# Altium schematic sheet Sheet1.SchDoc
size 279 x 279 mm; SheetNumber: 1; SheetTotal: 1
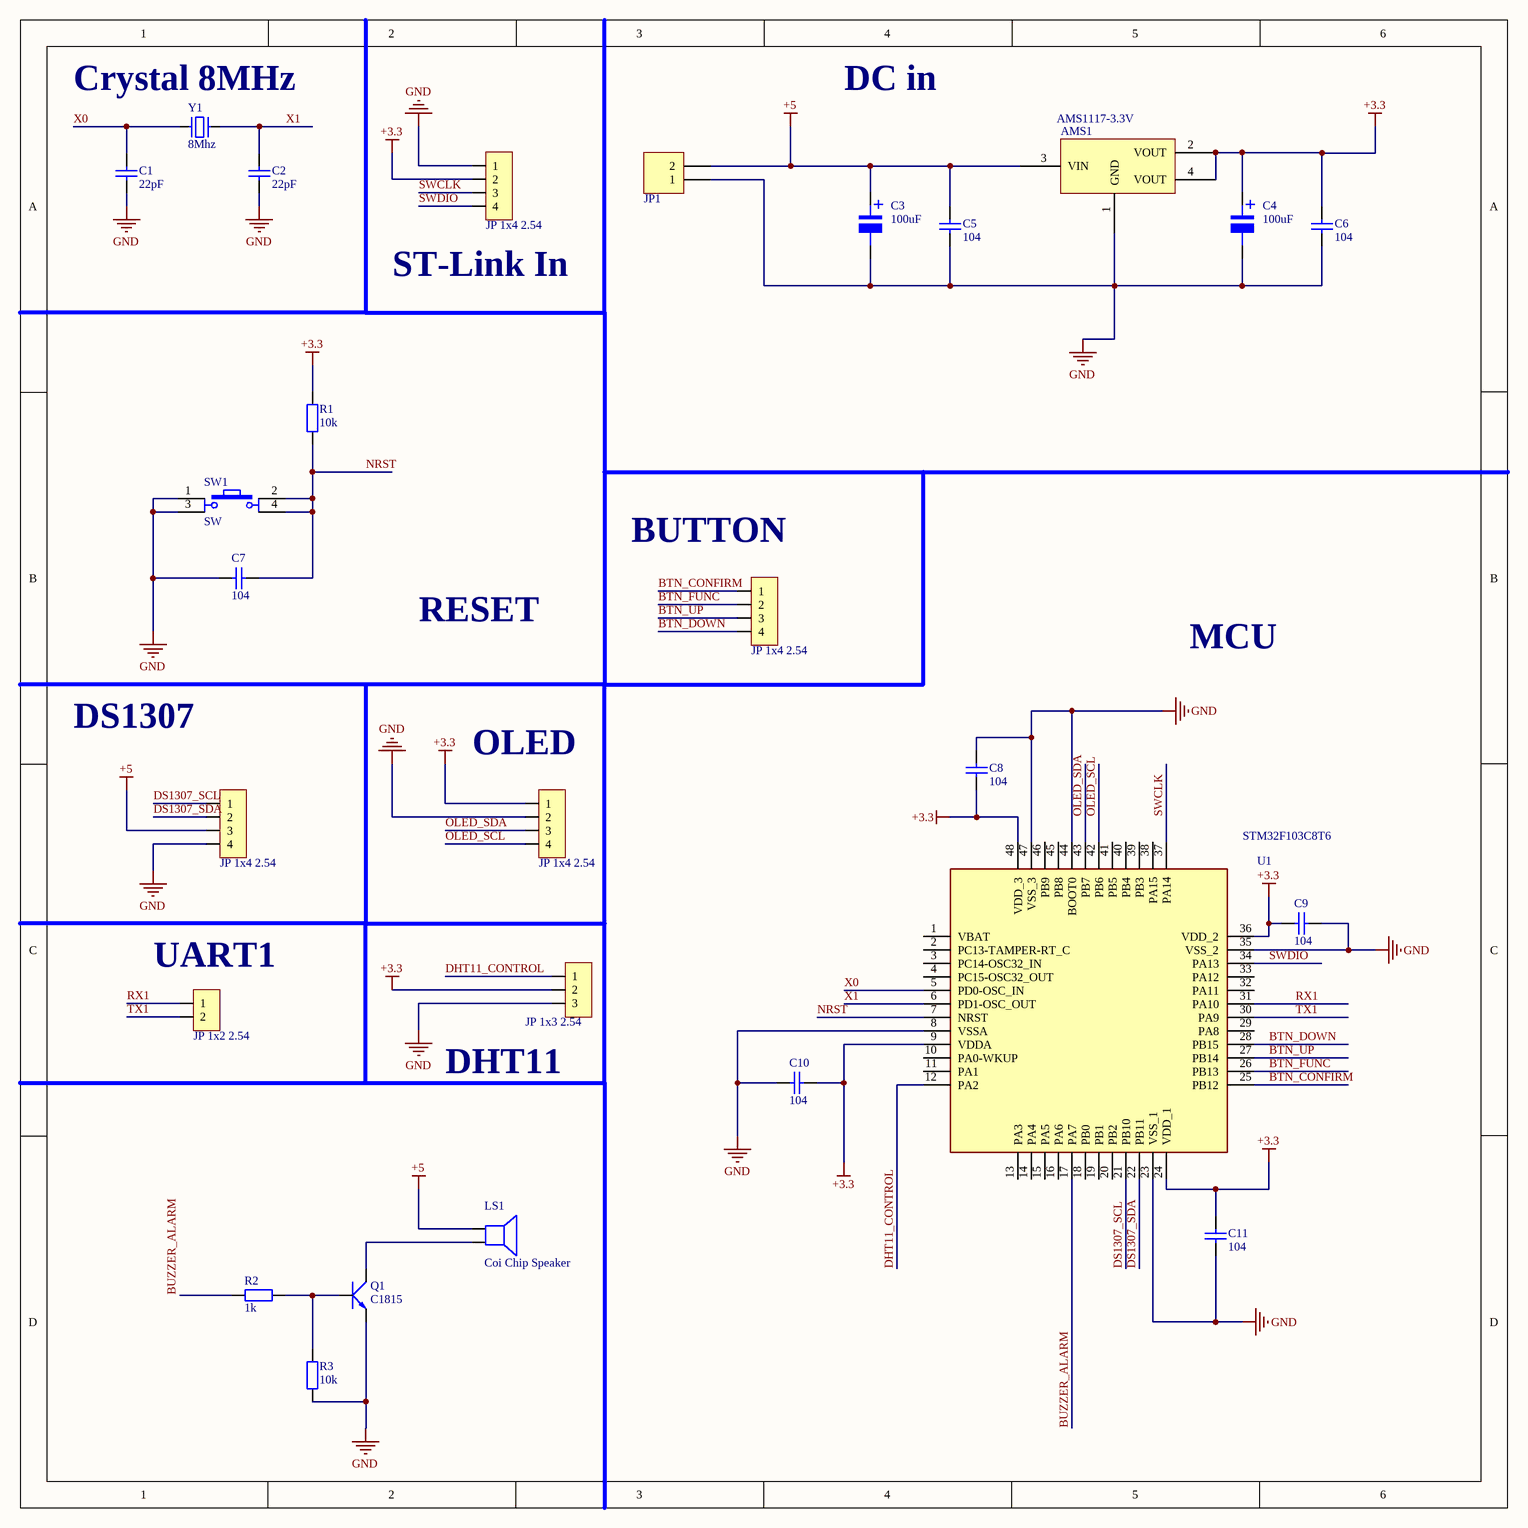
[diagram p0: Sheet1.SchDoc]

## Parts
AMS1  AMS1117-3.3V  [SOT223]
C1  22pF  [tu 1206]
C2  22pF  [tu 1206]
C3  100uF  [tu nhom 6.3 (d)]
C4  100uF  [tu nhom 6.3 (d)]
C5  104  [tu 1206]
C6  104  [tu 1206]
C7  104  [tu 1206]
C8  104  [tu 1206]
C9  104  [tu 1206]
C10  104  [tu 1206]
C11  104  [tu 1206]
JP1  Header 2_1  [HED2]  (value not drawn)
JP2  JP 1x4 2.54  [JP 1x4 DT]
JP3  JP 1x4 2.54  [JP 1x4 DT]
JP4  JP 1x4 2.54  [JP 1x4 DT]
JP5  JP 1x4 2.54  [JP 1x4 DT]
JP6  JP 1x3 2.54  [JP 1x3 DT]
JP7  JP 1x2 2.54  [JP 1x2 DT]
LS1  Coi Chip Speaker  [Coi Chip Speacker]
Q1  C1815  [TO92]
R1  10k  [tro smd 1206]
R2  1k  [tro smd 1206]
R3  10k  [tro smd 1206]
SW1  SW  [SW4]
U1  STM32F103C8T6  [LQFP-48_19.6_393_58X11_SMD]
Y1  8Mhz  [Thach Anh 2 chan SMD]

## Nets
+3.3: AMS1.2(VOUT) AMS1.4(VOUT) C4.1 C6.1 C8.2 C9.2 C10.1 C11.1 JP2.2 JP5.1 JP6.2 R1.2 U1.9(VDDA) U1.24(VDD_1) U1.36(VDD_2) U1.48(VDD_3)
+5: AMS1.3(VIN) C3.1 C5.1 JP1.2 JP4.3 LS1.1
GND: AMS1.1(GND) C1.2 C2.2 C3.2 C4.2 C5.2 C6.2 C7.1 C8.1 C9.1 C10.2 C11.2 JP1.1 JP2.1 JP4.4 JP5.2 JP6.3 Q1.1(E) R3.1 SW1.1 SW1.3 U1.8(VSSA) U1.23(VSS_1) U1.35(VSS_2) U1.44(BOOT0) U1.47(VSS_3)
BTN_CONFIRM: JP3.1 U1.25(PB12)
BTN_DOWN: JP3.4 U1.28(PB15)
BTN_FUNC: JP3.2 U1.26(PB13)
BTN_UP: JP3.3 U1.27(PB14)
BUZZER_ALARM: R2.1 U1.17(PA7)
DHT11_CONTROL: JP6.1 U1.12(PA2)
DS1307_SCL: JP4.1 U1.21(PB10)
DS1307_SDA: JP4.2 U1.22(PB11)
NRST: C7.2 R1.1 SW1.2 SW1.4 U1.7(NRST)
OLED_SCL: JP5.4 U1.42(PB6)
OLED_SDA: JP5.3 U1.43(PB7)
RX1: JP7.1 U1.31(PA10)
SWCLK: JP2.3 U1.37(PA14)
SWDIO: JP2.4 U1.34(PA13)
TX1: JP7.2 U1.30(PA9)
X0: C1.1 U1.5(PD0-OSC_IN) Y1.1
X1: C2.1 U1.6(PD1-OSC_OUT) Y1.2
NetLS1_2: LS1.2 Q1.2(C)
NetQ1_3: Q1.3(B) R2.2 R3.2

Not connected (* = marked no-connect by the designer): U1 1(VBAT) 2(PC13-TAMPER-RT_C) 3(PC14-OSC32_IN) 4(PC15-OSC32_OUT) 10(PA0-WKUP) 11(PA1) 13(PA3) 14(PA4) 15(PA5) 16(PA6) 18(PB0) 19(PB1) 20(PB2) 29(PA8) 32(PA11) 33(PA12) 38(PA15) 39(PB3) 40(PB4) 41(PB5) 45(PB8) 46(PB9)

## Notes on the sheet
- (near Y1) Crystal 8MHz
- DC in
- (near JP2) ST-Link In
- (near JP3) BUTTON
- RESET
- MCU
- DS1307
- (near JP5) OLED
- (near JP7) UART1
- (near JP6) DHT11
- (in symbol Tu Nhom 100uF 16V) +

## Library data of the parts
AMS1 = AMS1117 SMD: Dán; Value: AMS1117-3.3V SOT223; Don_Vi: Con; Ma_Hang: MH000596; Ghi_Chu: *; Kieu_Chan: *; Chung_Loai: Dán
C1 C2 = Tu 1206 22pF 50V 10%: Dán; Ma_Hang: MH004547; Don_Vi: Con; So_Chan: 2; Ten_Linh_Kien: Tụ 1206 22P 10% 50V; Chung_Loai: Dán; Kieu_Chan: *
C3 C4 = Tu Nhom 100uF 16V: Dán; Don_Vi: Con; So_Chan: 2; Ten_Linh_Kien: Tụ Nhôm 100uF 16V 6.3x5.4MM; Ma_Hang: MH002219; Chung_Loai: Dán; Kieu_Chan: *
C5-C11 = Tu 1206 104 50V 20%: Dán; Don_Vi: Con; So_Chan: 2; Ten_Linh_Kien: Tụ 1206 104-0.1uF 20% 50V; Ma_Hang: MH004544; Chung_Loai: Dán; Kieu_Chan: *
JP1 = Header 2_1: Header, 2-Pin; Manufacturer: Generic Components; Class: Connector; Value: Header 2
JP2-JP5 = JP 1x4 2.54 Duc Thang: Cắm; Ten_Linh_Kien: Jump Đơn Đực 2.54MM 1x40P Thẳng 11MM; Don_Vi: Con; Ma_Hang: MH000903; Ghi_Chu: *; Kieu_Chan: *; Chung_Loai: Cắm
JP6 = JP 1x3 2.54 Duc Thang: Cắm; Ten_Linh_Kien: Jump Đơn Đực 2.54MM 1x40P Thẳng 11MM; Don_Vi: Con; Ma_Hang: MH000903; Ghi_Chu: *; Kieu_Chan: *; Chung_Loai: Cắm
JP7 = JP 1x2 2.54 Duc Thang: Cắm; Ten_Linh_Kien: Jump Đơn Đực 2.54MM 1x40P Thẳng 11MM; Don_Vi: Con; Ma_Hang: MH000903; Ghi_Chu: *; Kieu_Chan: *; Chung_Loai: Cắm
LS1 = Coi Chip Speaker: Còi chip
Q1 = Trans C1815 DIP: NPN transistor; Value: C9014
R1 R3 = Tro 1206 1% 10k: Dán; Don_Vi: Con; So_Chan: 2; Ten_Linh_Kien: Trở 1206 1% 10k; Ma_Hang: MH005885; Chung_Loai: Dán; Kieu_Chan: *
R2 = Tro 1206 1% 1k: Dán; Don_Vi: Con; So_Chan: 2; Ten_Linh_Kien: Trở 1206 1% 1k; Ma_Hang: MH005880; Chung_Loai: Dán; Kieu_Chan: *
SW1 = SW4: Switch button 4 pin; Value: Button chip 4 pin
U1 = IC_STM32F103C8T6: ARM® Cortex®-M3 STM32F1 Microcontroller IC 32-Bit 72MHz 64KB (64K x 8) FLASH 48-LQFP (7x7) /; Manufacturer: STMicroelectronics; Alternate Part Number-1: NA; Manufacturer Part Number: STM32F103C8T6; Case/Package: LQFP48; Supplier-1: LCSC; Supplier Part Number-1: STM32F103C8T6
Y1 = Thach Anh 2 chan SMD: Crystal For all Crystal 2pin.; Value: 4Mhz